# Altium schematic sheet 40 Pin BS, FAN Connector and Test LEDs.SchDoc: RK3399 COB Design V1.0
size A3; Author: ABC; Organization: Altium Limited; Address1: L3, 12a Rodborough Rd; Address2: Frenchs Forest; Address3: NSW; Address4: Australia 2086; DocumentNumber: 26; SheetNumber: 26; SheetTotal: 27; PROJECT CODE: A_V1.0
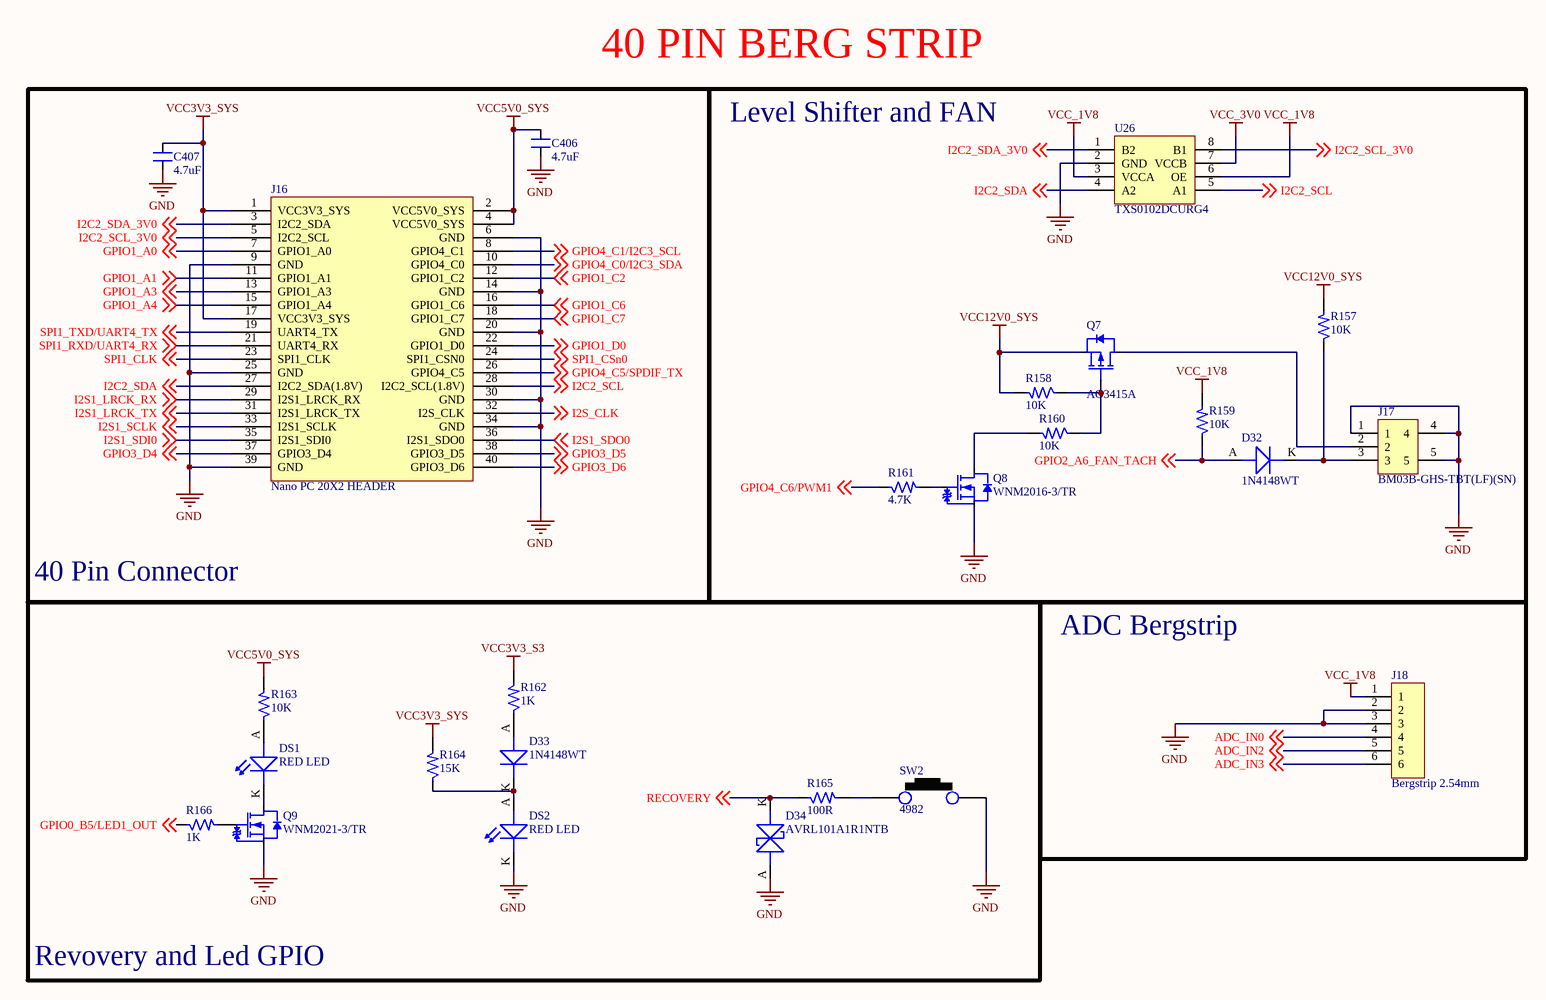
[diagram p0: 40 Pin BS, FAN Connector and Test LEDs.SchDoc]

## Parts
C406  4.7uF  [CAP_0603]
C407  4.7uF  [CAP_0603]
D32  1N4148WT  [DIO_SOD523]
D33  1N4148WT  [DIO_SOD523]
D34  AVRL101A1R1NTB  [DIO_0402_SMD]
DS1  RED LED  [LED_0805]
DS2  RED LED  [LED_0805]
J16  Nano PC 20X2 HEADER  [CON40_100_ADA2223_ST_TH]
J17  BM03B-GHS-TBT(LF)(SN)  [CON3_50_BM03B-GHS-TBT(LF)(SN)_TH_RA]
J18  Bergstrip 2.54mm  [CON6_100_59D78_TH_ST]
Q7  AO3415A  [SOT 23-3]
Q8  WNM2016-3/TR  [SOT 23-3]
Q9  WNM2021-3/TR  [SOT-323-3]
R157  10K  [RES_0603]
R158  10K  [RES_0603]
R159  10K  [RES_0603]
R160  10K  [RES_0603]
R161  4.7K  [RES_0603]
R162  1K  [RES_0603]
R163  10K  [RES_0603]
R164  15K  [RES_0603]
R165  100R  [RES_0603]
R166  1K  [RES_0603]
SW2  4982  [SW_177_39.3X77.7_SMD]
U26  TXS0102DCURG4  [VSSOP-8_19.6_157_33X11_SMD]

## Blocks framed on the sheet
40 Pin Connector: C406 C407 J16
Level Shifter and FAN: D32 J17 Q7 Q8 R157-R161 U26
Revovery and Led GPIO: D33 D34 DS1 DS2 Q9 R162-R166 SW2
ADC Bergstrip: J18

## Nets
GND: C406.1 C407.1 D34.A DS2.K(CATHODE) J16.6(GND) J16.9(GND) J16.14(GND) J16.20(GND) J16.25(GND) J16.30(GND) J16.34(GND) J16.39(GND) J17.1 J17.4 J17.5 J18.2 J18.3 Q8.2(S) Q9.2(S) SW2.2 U26.2(GND)
VCC3V3_S3: R162.2
VCC3V3_SYS: C407.2 J16.1(VCC3V3_SYS) J16.17(VCC3V3_SYS) R164.2
VCC5V0_SYS: C406.2 J16.2(VCC5V0_SYS) J16.4(VCC5V0_SYS) R163.2
VCC12V0_SYS: Q7.2(S) R157.2 R158.2
VCC_1V8: J18.1 R159.2 U26.3(VCCA) U26.6(OE)
VCC_3V0: U26.7(VCCB)
ADC_IN0: J18.4 ; off-sheet ADC_IN0
ADC_IN2: J18.5 ; off-sheet ADC_IN2
ADC_IN3: J18.6 ; off-sheet ADC_IN3
GPIO0_B5/LED1_OUT: R166.1 ; off-sheet GPIO0_B5/LED1_OUT
GPIO1_A0: J16.7(GPIO1_A0) ; off-sheet GPIO1_A0
GPIO1_A1: J16.11(GPIO1_A1) ; off-sheet GPIO1_A1
GPIO1_A3: J16.13(GPIO1_A3) ; off-sheet GPIO1_A3
GPIO1_A4: J16.15(GPIO1_A4) ; off-sheet GPIO1_A4
GPIO1_C2: J16.12(GPIO1_C2) ; off-sheet GPIO1_C2
GPIO1_C6: J16.16(GPIO1_C6) ; off-sheet GPIO1_C6
GPIO1_C7: J16.18(GPIO1_C7) ; off-sheet GPIO1_C7
GPIO1_D0: J16.22(GPIO1_D0) ; off-sheet GPIO1_D0
GPIO2_A6_FAN_TACH: D32.A(ANODE) R159.1 ; off-sheet GPIO2_A6_FAN_TACH
GPIO3_D4: J16.37(GPIO3_D4) ; off-sheet GPIO3_D4
GPIO3_D5: J16.38(GPIO3_D5) ; off-sheet GPIO3_D5
GPIO3_D6: J16.40(GPIO3_D6) ; off-sheet GPIO3_D6
GPIO4_C0/I2C3_SDA: J16.10(GPIO4_C0) ; off-sheet GPIO4_C0/I2C3_SDA
GPIO4_C1/I2C3_SCL: J16.8(GPIO4_C1) ; off-sheet GPIO4_C1/I2C3_SCL
GPIO4_C5/SPDIF_TX: J16.26(GPIO4_C5) ; off-sheet GPIO4_C5/SPDIF_TX
GPIO4_C6/PWM1: R161.1 ; off-sheet GPIO4_C6/PWM1
I2C2_SCL: J16.28(I2C2_SCL(1.8V)) U26.5(A1) ; off-sheet I2C2_SCL
I2C2_SCL_3V0: J16.5(I2C2_SCL) U26.8(B1) ; off-sheet I2C2_SCL_3V0
I2C2_SDA: J16.27(I2C2_SDA(1.8V)) U26.4(A2) ; off-sheet I2C2_SDA
I2C2_SDA_3V0: J16.3(I2C2_SDA) U26.1(B2) ; off-sheet I2C2_SDA_3V0
I2S1_LRCK_RX: J16.29(I2S1_LRCK_RX) ; off-sheet I2S1_LRCK_RX
I2S1_LRCK_TX: J16.31(I2S1_LRCK_TX) ; off-sheet I2S1_LRCK_TX
I2S1_SCLK: J16.33(I2S1_SCLK) ; off-sheet I2S1_SCLK
I2S1_SDI0: J16.35(I2S1_SDI0) ; off-sheet I2S1_SDI0
I2S1_SDO0: J16.36(I2S1_SDO0) ; off-sheet I2S1_SDO0
I2S_CLK: J16.32(I2S_CLK) ; off-sheet I2S_CLK
RECOVERY: D34.K R165.1 ; off-sheet RECOVERY
SPI1_CLK: J16.23(SPI1_CLK) ; off-sheet SPI1_CLK
SPI1_CSn0: J16.24(SPI1_CSN0) ; off-sheet SPI1_CSn0
SPI1_RXD/UART4_RX: J16.21(UART4_RX) ; off-sheet SPI1_RXD/UART4_RX
SPI1_TXD/UART4_TX: J16.19(UART4_TX) ; off-sheet SPI1_TXD/UART4_TX
NetD32_K: D32.K(CATHODE) J17.3 R157.1
NetD33_A: D33.A(ANODE) R162.1
NetD33_K: D33.K(CATHODE) DS2.A(ANODE) R164.1
NetDS1_A: DS1.A(ANODE) R163.1
NetDS1_K: DS1.K(CATHODE) Q9.3(D)
NetJ17_2: J17.2 Q7.3(D)
NetQ7_1: Q7.1(G) R158.1 R160.1
NetQ8_1: Q8.1(G) R161.2
NetQ8_3: Q8.3(D) R160.2
NetQ9_1: Q9.1(G) R166.2
NetR165_2: R165.2 SW2.1

## Notes on the sheet
- 40 PIN BERG STRIP
- TITLE:
- DOCUMENT NAME:
- SCALE 1:1
- This document is copyright of Esteempcb and shall not be revealed, produced, copied, in whole or in part, nor
- PROJECT CODE:
- TEMPLATE:
- A3
- AUTHOR:
- Sheet
- of
- used for any purpose other than submitted.

## Library data of the parts
C406 C407 = CAP_4.7uF-16V-10%-0603: 4.7µF ±10% 16V Ceramic Capacitor X5R 0603 (1608 Metric) /; Manufacturer: Murata Electronics; Manufacturer Part Number: GRM188R61C475KAAJD; Case/Package: 0603; Supplier-1: Digikey
D32 D33 = DIO_75V-200mA-SOD-523F: Diode Standard 100V 300mA (DC) Surface Mount SOD-123; Manufacturer: FAIRCHILD; Manufacturer Part Number: 1N4148WT; Case/Package: SOD123; Supplier-1: SIRICOM
D34 = DIO-T_10V-39V-0402: 39V Varistor 1 Circuit Surface Mount, MLCV 0402 (1005 Metric); Manufacturer: TDK Corporation; Manufacturer Part Number: AVRL101A1R1NTB; Supplier-1: Digikey; Case/Package: 0402
DS1 DS2 = LED_RED-2V-20mA-0805: Red 631nm LED Indication - Discrete 2V 0805 (2012 Metric); Manufacturer: Vishay Lite-On; Manufacturer Part Number: LTST-C171KRKT; Case/Package: 0805; Supplier-1: SP ROAD
J16 = CON-BS-SKT_20X2-100-ST-TH: 40 Pins, 2 Row 2.54mm Pitch, Straight bergstrip, Female (Stackup); Manufacturer Part Number: ADA2223; Manufacturer: FCI / Amphenol; Case/Package: TH-CON; Supplier-1: TANOTIS
J17 = CON-PLG_3X1-50-RA-TH_1: Connector Header Surface Mount 3 position 0.049" (1.25mm); Manufacturer: JST Sales America Inc.; Nymble Part Number: 1EA-AA-0562; Mating Part Number: GHR-03V-S; Crimp Part Number: SSHL-002T-P0.2; Alternate Part Number-1: NA; Manufacturer Part Number: BM03B-GHS-TBT(LF)(SN); Case/Package: TH-CON; Supplier-1: Digikey; Supplier Part Number-1: BM03B-GHS-TBT(LF)(SN); Category: Connector; Number of Pins: 3
J18 = CON-BS-SKT_6X1-100-ST-TH: 6 Pins, 1 Row 2.54mm Pitch, Straight bergstrip, Female; Manufacturer: Molex; Manufacturer Part Number: 22-10-2061; Case/Package: TH-CON; Supplier-1: SP ROAD
Q7 = MOSFET-P_20V-5A-SOT23-3: P-Channel 20V 5A (Ta) 1.5W (Ta) Surface Mount SOT-23-3L; Manufacturer: Alpha & Omega Semiconductor Inc.; Manufacturer Part Number: AO3415A; Case/Package: SOT-23-3; Supplier-1: Digikey
Q8 = MOSFET-N_20V-2.9A-SOT-23: N Channel 20V 2.9A 1V @ 250uA 47mΩ @ 3.6A,4.5V 700mW SOT-23(SOT-23-3) MOSFET RoHS /; Manufacturer: WILLSEMI(Will Semicon); Manufacturer Part Number: WNM2016-3/TR; Case/Package: SOT-23(SOT-23-3); Supplier-1: LCSC
Q9 = MOSFET-N_20V-820mA-SOT-323: N Channel 20V 820mA 850mV @ 250uA 310mΩ @ 550mA,4.5V 310mW SOT-323(SC-70) MOSFET RoHS /; Manufacturer: WILLSEMI(Will Semicon); Manufacturer Part Number: WNM2021-3/TR; Case/Package: SOT-323(SC-70); Supplier-1: LCSC
R157-R160 R163 = RES_10K-0.1W-1%-0603: 10 kOhms ±1% 0.1W, 1/10W Chip Resistor 0603 (1608 Metric) Thick Film /; Manufacturer: Yageo; Manufacturer Part Number: RC0603FR-0710KL; Case/Package: 0603; Supplier-1: Digikey
R161 = RES_4.7K-0.1W-1%-0603: 4.7 kOhms ±1% 0.1W, 1/10W Chip Resistor 0603 (1608 Metric) Automotive AEC-Q200, Moisture Resistant Thick Film /; Manufacturer: TE Connectivity Passive Product; Manufacturer Part Number: CRGCQ0603F4K7; Case/Package: 0603; Supplier-1: Digikey
R162 R166 = RES_1K-0.1W-1%-0603: 1 kOhms ±1% 0.1W, 1/10W Chip Resistor 0603 (1608 Metric) Thick Film /; Manufacturer: Yageo; Manufacturer Part Number: RC0603FR-071KL; Case/Package: 0603; Supplier-1: Digikey
R164 = RES_15K-0.1W-1%-0603: 15 kOhms ±1% 0.1W, 1/10W Chip Resistor 0603 (1608 Metric) Thick Film /; Manufacturer: Yageo; Manufacturer Part Number: RC0603FR-0715KL; Suplier-1: Digikey; Case/Package: 0603
R165 = RES_100R-0.1W-1%-0603: 100 Ohms ±1% 0.1W, 1/10W Chip Resistor 0603 (1608 Metric) Thick Film /; Manufacturer: Yageo; Manufacturer Part Number: RC0603FR-07100RL; Case/Package: 0603; Supplier-1: Digikey
SW2 = SW1_4982: Tactile Switch 3x4x2mm SMD 2-Pin; Manufacturer: NA; Manufacturer Part Number: NA; Case/Package: SMD; Supplier-1: Sunrom
U26 = IC_TXS0102DCURG4: Voltage Level Translator Bidirectional 1 Circuit 2 Channel 24Mbps 8-VSSOP; Manufacturer: Texas Instruments; Manufacturer Part Number: TXS0102DCURG4; Case/Package: VSSOP8; Supplier-1: Mouser